# EAGLE design Smart_Plant (EAGLE 9.5.1)
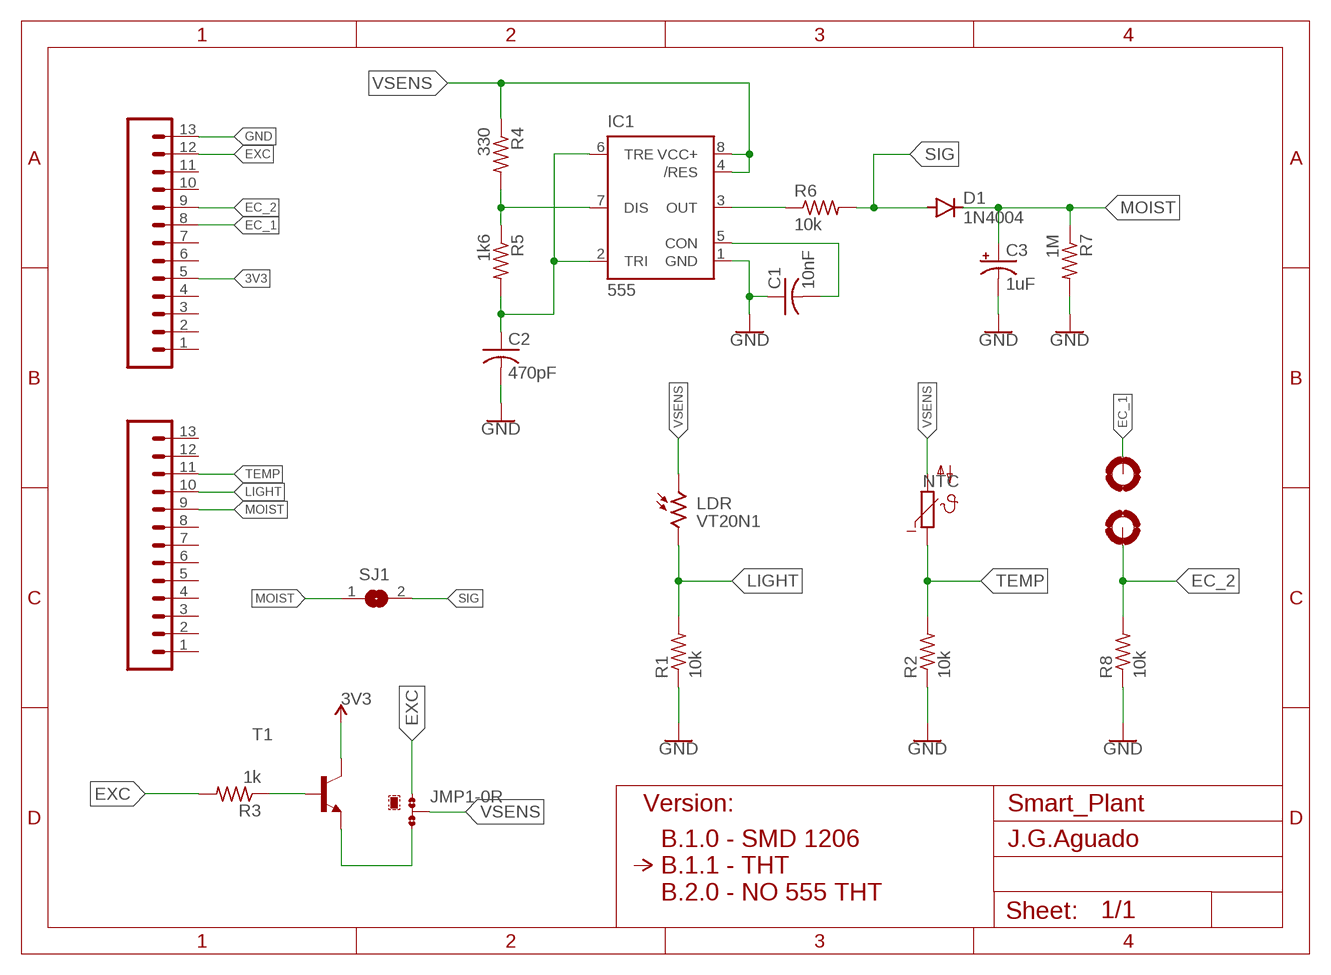
[diagram p0: schematic, sheet 1]

## Parts
C1  10nF  C-US050-025X075  [C050-025X075]
C2  470pF  C-US050-025X075  [C050-025X075]
C3  1uF  CPOL-USE2.5-5  [E2,5-5]
D1  1N4004  [DO41-10]
H1  MOUNT-PAD-ROUND3.0  [3,0-PAD]
H2  MOUNT-PAD-ROUND3.0  [3,0-PAD]
IC1  555  555KIT  [DIP08-KIT]
JMP1  0R-JUMPB  [B0R-JMP]
JP1  CONN_13  [1X13]
JP2  CONN_13  [1X13]
LDR  VT20N1  [TO46-VT200]
NTC  R1206  NTC640  [P640]
R1  10k  R-US_0207/10  [0207/10]
R2  10k  R-US_0207/10  [0207/10]
R3  1k  R-US_0207/10  [0207/10]
R4  330  R-US_0207/10  [0207/10]
R5  1k6  R-US_0207/10  [0207/10]
R6  10k  R-US_0207/10  [0207/10]
R7  1M  R-US_0207/10  [0207/10]
R8  10k  R-US_0207/10  [0207/10]
SJ1  SJ  [SJ]
T1  -NPN-TO92-ECB  [TO92-ECB]

## Nets
3V3: JP1.5 T1.C ; supply symbol labelled 3.3V
EC_1: H1.B3,0(MOUNT) JP1.8
EC_2: H2.B3,0(MOUNT) JP1.9 R8.2
EXC: JMP1.1 JP1.12 R3.2
GND: C1.1 C2.2 C3.- IC1.1(GND) JP1.13 R1.1 R2.1 R7.2 R8.1
LIGHT: JP2.10 LDR.2 R1.2
MOIST: C3.+ D1.C JP2.9 R7.1 SJ1.1
N$1: R3.1 T1.B
N$3: C2.1 IC1.2(TRI) IC1.6(TRE) R5.2
N$4: IC1.7(DIS) R4.2 R5.1
N$6: IC1.3(OUT) R6.1
N$9: C1.2 IC1.5(CON)
N$10: JMP1.3 T1.E
SIG: D1.A R6.2 SJ1.2
TEMP: JP2.11 NTC.1 R2.2
VSENS: IC1.4(/RES) IC1.8(VCC+) JMP1.2 LDR.1 NTC.2 R4.1
Unconnected: JP1.1 JP1.2 JP1.3 JP1.4 JP1.6 JP1.7 JP1.10 JP1.11 JP2.1 JP2.2 JP2.3 JP2.4 JP2.5 JP2.6 JP2.7 JP2.8 JP2.12 JP2.13

## Notes on the sheet
- Version:
- J.G.Aguado
- B.1.0 - SMD 1206
  B.1.1 - THT 
  B.2.0 - NO 555 THT

## Library data of the parts
C1 C2 = rcl:C-US: CAPACITOR, American symbol; SPICEPREFIX: C
C3 = rcl:CPOL-US: POLARIZED CAPACITOR, American symbol; SPICEPREFIX: C
D1 = diode:1N4004: DIODE general purpose rectifier, 1 A
H1 H2 = holes:MOUNT-PAD-ROUND: MOUNTING PAD, round
IC1 = SparkFun-IC-Special-Function:555: General purpose bipolar Timer Datasheet <http://www.sparkfun.com/datasheets/Components/General/ne555.pdf> SparkFun Products SparkFun SparkPunk Sequencer Kit <https://www.sparkfun.com/products/12707> (KIT-12707) Storefront Component: 555 Timer <https://www.sparkfun.com/products/9273> (COM-09273) Two parts valid for production: VFP: IC-11930 (M7555 PTH) VFP: IC-09173 (555 PTH) - Preferred; PROD_ID: IC-09173; PROD_ID_ALT: IC-11930
JMP1 = jump-0r-smd:0R-JUMP: SMD 0R 0805 Jumper
JP1 JP2 = SparkFun-Connectors:CONN_13: Multi connection point. Often used as Generic Header-pin footprint for 0.1 inch spaced/style header connections On any of the 0.1 inch spaced packages, you can populate with these: Break Away Headers - Straight <https://www.sparkfun.com/products/116> (PRT-00116) Break Away Male Headers - Right Angle <https://www.sparkfun.com/products/553> (PRT-00553) Female Headers <https://www.sparkfun.com/products/115> (PRT-00115) Break Away Headers - Machine Pin <https://www.sparkfun.com/products/117> (PRT-00117) Break Away Female Headers - Swiss Machine Pin <https://www.sparkfun.com/products/743> (PRT-00743) For SCREWTERMINALS and SPRING TERMINALS visit here: Screw Terimnals on SparkFun.com <https://www.sparkfun.com/search/results?term=Screw+Terminals> (5mm/3.5mm/2.54mm spacing) This device is also useful as a general connection point to wire up your design to another part of your project. Our various solder wires solder well into these plated through hole pads. Hook-Up Wire - Assortment (Stranded, 22 AWG) <https://www.sparkfun.com/products/11375> (PRT-11375) Hook-Up Wire - Assortment (Solid Core, 22 AWG) <https://www.sparkfun.com/products/11367> (PRT-11367) View the entire wire category on our website here <https://www.sparkfun.com/categories/141> Special notes: Molex polarized connector foot print use with SKU : PRT-08231 with associated crimp pins and housings. 1MM SMD Version SKU: PRT-10208 NOTES ON THE VARIANTS LOCK and LOCK_LONGPADS... This footprint was designed to help hold the alignment of a through-hole component (i.e. 6-pin header) while soldering it into place. You may notice that each hole has been shifted either up or down by 0.005 of an inch from it's more standard position (which is a perfectly straight line). This slight alteration caused the pins (the squares in the middle) to touch the edges of the holes. Because they are alternating, it causes a "brace" to hold the component in place. 0.005 has proven to be the perfect amount of "off-center" position when using our standard breakaway headers. Although looks a little odd when you look at the bare footprint, once you have a header in there, the alteration is very hard to notice. Also,if you push a header all the way into place, it is covered up entirely on the bottom side.
LDR = photo-elements:VT2*: Photoconductive Cell VT200 Series Source: http://optoelectronics.perkinelmer.com/content/Datasheets/DTS_vt200seriesdatasheet.pdf
NTC = ptc-ntc:NTC640: PHILIPS NTC; OC_FARNELL: unknown; OC_NEWARK: unknown
R1-R8 = rcl:R-US_: RESISTOR, American symbol; SPICEPREFIX: R
SJ1 = jumper:SJ: SMD solder JUMPER
T1 = transistor:*-NPN-: NPN Transistror BF959 corrected 2008.03.06

## Net classes
0 default: clearance 0.205 mm

## Board
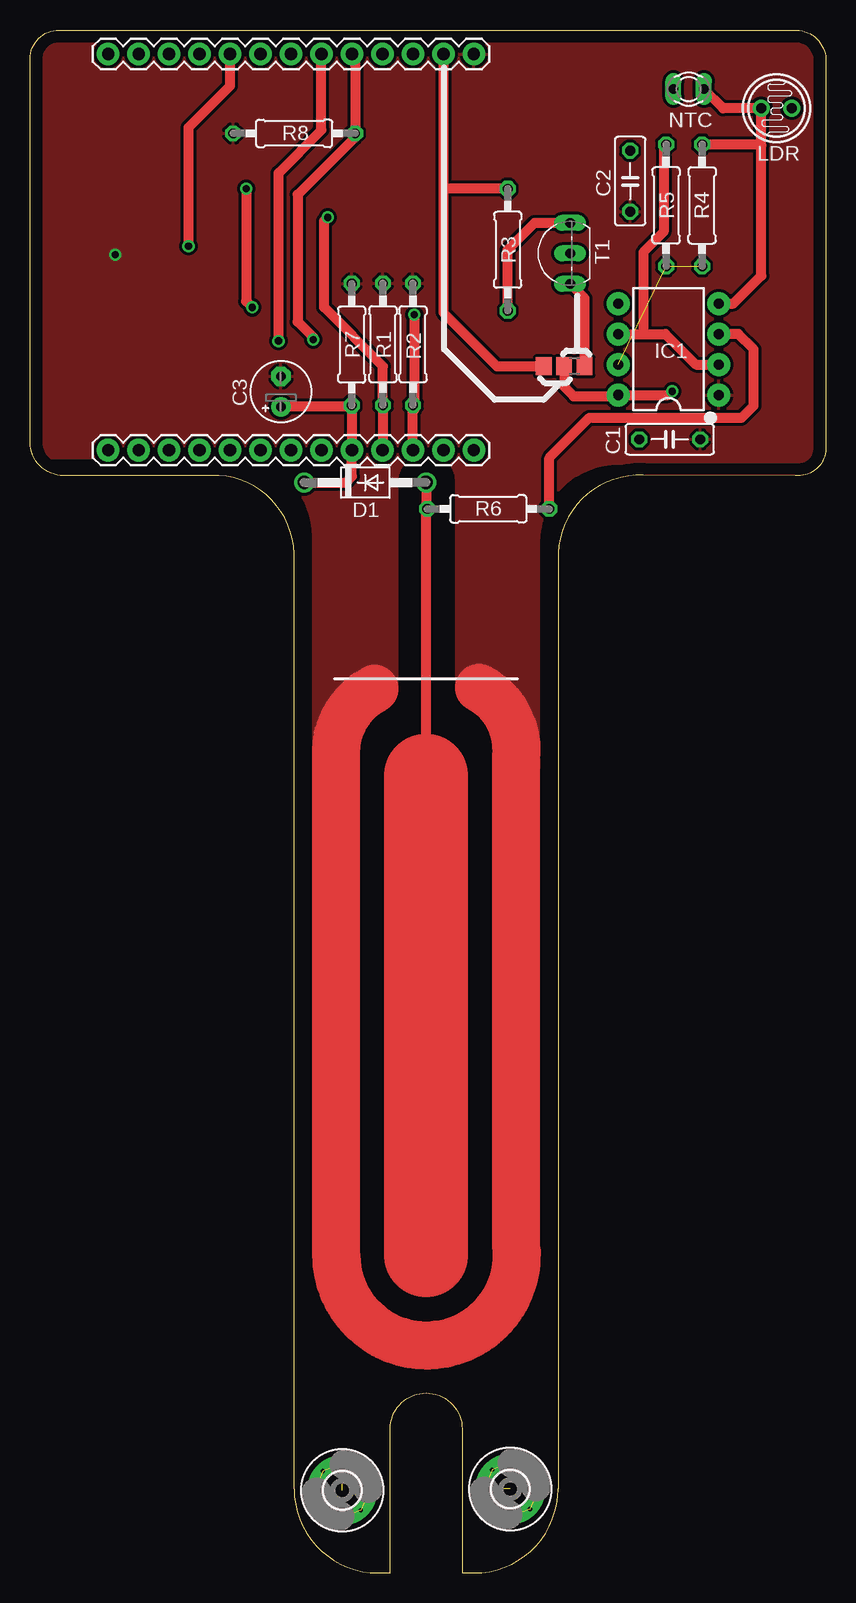
[diagram p1: board, top side]
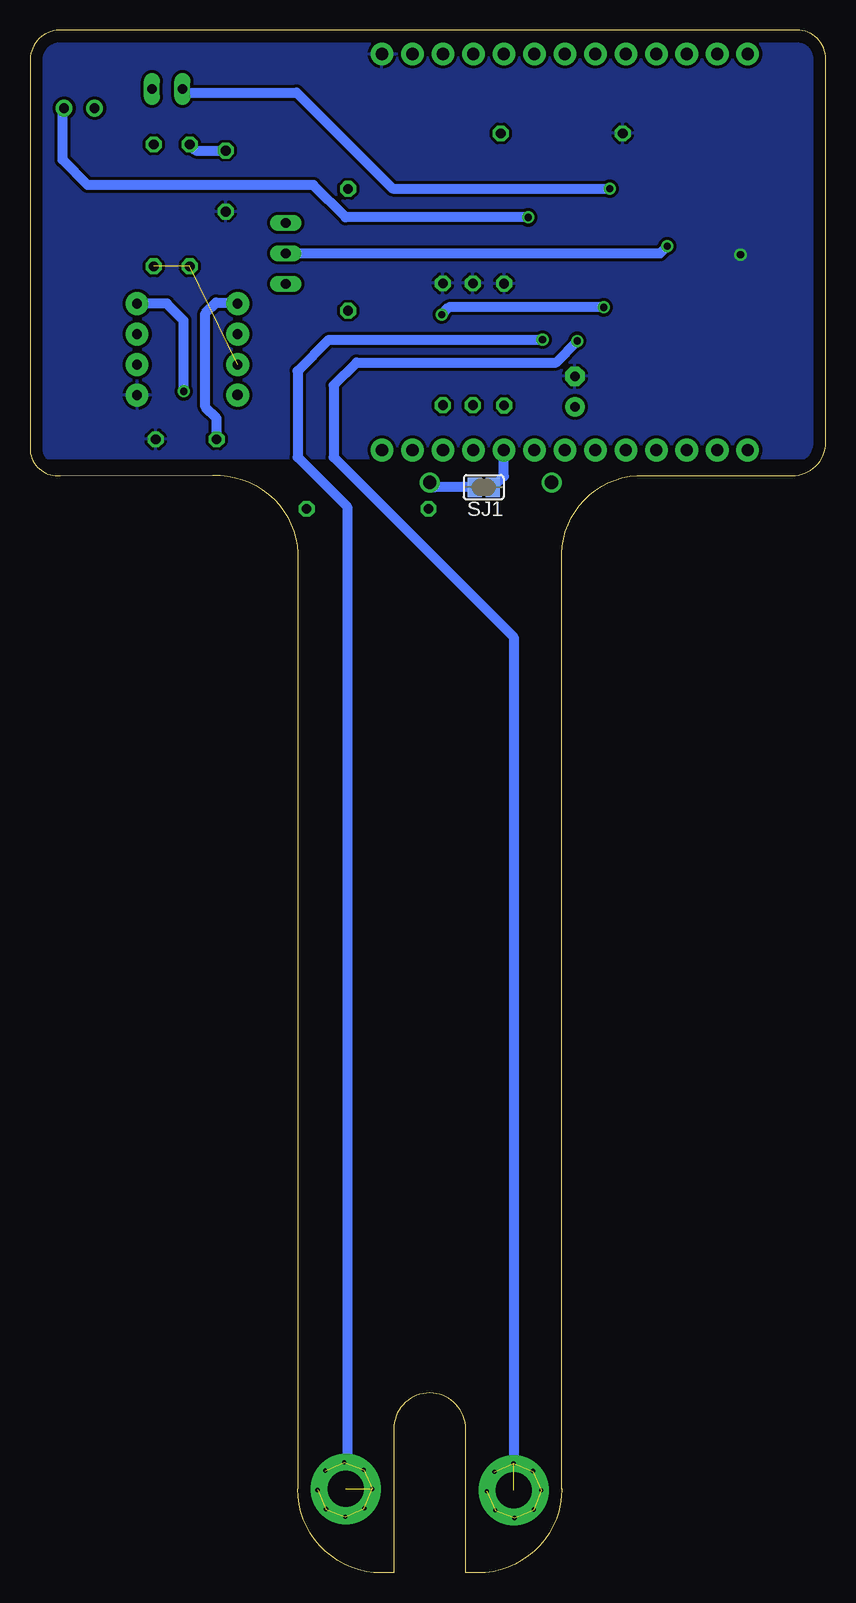
[diagram p2: board, bottom side, seen from below]

Size 66.32 x 128.62 mm. Coordinates in mm from the lower left corner, seen from the top.
Outline: 2.42,128.62 63.65,128.62 arc-90 66.32,126.21 66.32,123.86 66.29,121.46 66.29,98.01 66.32,96.86 66.32,93.53 arc-90 63.78,91.49 51.11,91.5 arc90 44.01,85 44.01,7 arc-90 37.01,0 36.01,0 36.01,12 arc90 33.01,15 arc90 30.01,12 30.01,0 29.01,0 arc-90 22.01,7 22.01,84.99 arc90 15.11,91.49 2.54,91.49 arc-90 0.01,94.52 0.01,126.21 arc-90 2.42,128.62
Copper layers (1*16): Top 0.035mm / dielectric 1.5mm / Bottom 0.035mm
Design rules "default": minimum track width 6mil, minimum drill 0.35mm, track to track 6mil, track to pad 6mil, pad to pad 6mil, via to via 6mil, smd to smd 6mil, copper to edge 40mil, drill to drill 6mil, minimum pad ring 10mil, minimum via ring 8mil, stop-mask expansion 4mil, vias tented up to drill 0mil, thermal gap 10mil

### Footprints (pad centres in the part's own frame; a part is rotated, then mirrored left to right if it is on the bottom)
C050-025X075 = drill 0.813 octagon: 1 -2.54,0; 2 2.54,0
E2,5-5 = drill 0.813 pad 1.6: + -1.27,0 | drill 0.813 pad 1.6 octagon: - 1.27,0
DO41-10 = drill 1.118: A 5.08,0; C -5.08,0
3,0-PAD = drill 3 pad 5.842: B3,0 0,0
DIP08-KIT = drill 0.813 pad 1.905: 1 -3.81,-4.191; 2 -1.27,-4.191; 3 1.27,-4.191; 4 3.81,-4.191; 5 3.81,4.191; 6 1.27,4.191; 7 -1.27,4.191 | drill 0.864 pad 1.905: 8 -3.81,4.191
B0R-JMP = smd 1.5 x 1.3: 1 0,1.7; 2 0,0; 3 0,-1.7
1X13 = drill 1.016 pad 1.88: 1 0,0; 2 2.54,0; 3 5.08,0; 4 7.62,0; 5 10.16,0; 6 12.7,0; 7 15.24,0; 8 17.78,0; 9 20.32,0; 10 22.86,0; 11 25.4,0; 12 27.94,0; 13 30.48,0
TO46-VT200 = drill 0.8 pad 1.4: 1 -1.27,0; 2 1.27,0
P640 = drill 0.813 long: 1 -1.27,0; 2 1.27,0
0207/10 = drill 0.813 octagon: 1 -5.08,0; 2 5.08,0
SJ = smd 1.168 x 1.6: 1 -0.762,0; 2 0.762,0
TO92-ECB = drill 0.813 long: B 2.54,0; C 0,0; E -2.54,0

### Placement (x,y rotation side)
C1  53.31,94.5 180 top
C2  50.01,116.02 270 top
C3  20.91,98.48 90 top
D1  27.93,90.9 0 top
H1  26.01,6.9 0 top
H2  40.01,7 0 top
IC1  53.21,102 90 top
JMP1  44.51,100.6 90 top
JP1  6.51,126.62 0 top
JP2  6.51,93.6 0 top
LDR  62.21,122.1 0 top
NTC  54.89,123.7 0 top
R1  29.41,102.42 270 top
R2  31.91,102.42 270 top
R3  39.81,110.3 90 top
R4  56.01,114 270 top
R5  53.01,114 90 top
R6  38.19,88.7 180 top
R7  26.81,102.4 90 top
R8  22.01,120 0 top
SJ1  28.51,90.5 180 bottom
T1  45.01,110 90 top

### Tracks (layer width: path | path; a pad name or v marks a point on that pad's centre or on a via)
3V3  (via drill 0.6)
  Top 0.813: v13.21,110.6 13.21,120.5 16.67,123.96 JP1.5
  Bottom 0.813: T1.C 13.81,110 v13.21,110.6
EC_1  (via drill 0.35, 0.6)  (9 unrouted)
  Top 0.813: v20.71,102.7 20.71,116.7 24.29,120.28 JP1.8
  Bottom 0.813: v20.71,102.7 v20.7,102.71 20.67,102.71 22.48,100.9 39.11,100.9 41.01,99 41.01,93 26.01,78 26.01,7
  other vias: 23.71,6.9 24.41,8.5 26.02,9.13 27.62,8.44 28.26,6.82 27.56,5.22 25.94,4.59 24.35,5.28
EC_2  (via drill 0.35, 0.6)  (8 unrouted)
  Top 0.813: JP1.9 27.09,125.7 R8.2 27.09,119.68 22.31,114.9 22.31,104.3 23.61,103 v23.61,102.8
  Bottom 0.813: v23.61,102.8 41.41,102.8 44.01,100.2 44.01,93 39.9,88.89 39.9,7.11 H2.B3,0
  other vias: 37.81,7 38.51,8.6 40.12,9.23 41.72,8.54 42.36,6.92 41.66,5.32 40.04,4.69 38.45,5.38
EXC
  Top 0.813: JP1.12 34.45,115.4 | 34.45,115.4 34.45,105.06 38.91,100.6 JMP1.1 | R3.2 39.79,115.4 34.45,115.4
GND  (via drill 0.6)
  Top 4: 37.41,73.8 arc-68 40.51,67.99 40.51,27.44 arc-187 25.51,26.5 25.51,68.5 arc-62 28.71,73.7
  other vias: 7.11,109.9
  pour Bottom (isolate 0.254): 0.01,128.62 66.32,128.62 66.32,92.99 0.01,92.99
  pour Top (isolate 0.254): 66.51,128.62 0.2,128.62 0.2,92.99 17.02,92.99 arc-90 23.61,86.4 23.61,67.3 27.11,67.3 27.11,73.5 30.61,73.5 30.61,91 arc-90 33.06,93.45 arc-90 35.51,91 35.51,74 arc-90 42.41,67.1 42.41,85.9 arc-90 49.01,92.5 66.51,92.49
LIGHT  (via drill 0.6)
  Top 0.813: JP2.10 29.41,93.64 R1.2 29.41,100.6 24.51,105.5 24.51,112.7 v24.81,113
  Bottom 0.813: v24.81,113 40.01,113 42.71,115.7 61.51,115.7 63.61,117.8 63.61,121.97 LDR.2
MOIST
  Top 0.813: C3.+ 26.7,97.21 R7.1 26.83,97.3 JP2.9 26.83,91.42 26.31,90.9 D1.C 23.15,90.9
  Bottom 0.813: SJ1.1 26.83,91.42 JP2.9
N$1
  Top 0.813: R3.1 39.81,110.3 42.05,112.54 T1.B
N$3
  Top 0.813: IC1.6 51.11,103.27 | 51.11,103.27 52.94,103.27 55.48,100.73 IC1.2 | R5.2 52.81,118.88 52.81,111.8 51.11,110.1 51.11,103.27
  Bottom 0.813: R5.2 52.49,118.56 C2.1
N$4  (2 unrouted)
N$6
  Top 0.813: R6.1 43.27,92.96 46.61,96.3 59.31,96.3 60.31,97.3 60.31,102 59.04,103.27 IC1.3
N$9
  Bottom 0.813: C1.2 50.77,96.26 51.71,97.2 51.71,105 50.81,105.9 49.11,105.9 IC1.5
N$10
  Top 0.813: JMP1.3 46.21,106.26 T1.E
SIG
  Top 0.813: 33.01,66.47 33.01,88.7 | R6.2 33.01,88.7 | D1.A 33.01,88.7
  Top 7: 33.01,26.5 33.01,66.47
  Bottom 0.813: SJ1.2 32.61,90.5 D1.A
TEMP  (via drill 0.6)
  Top 0.813: JP2.11 31.91,96.8 | 31.91,96.8 R2.2 | v18.01,115.4 18.01,106 v18.51,105.5 | v32.01,104.9 32.01,96.9 31.91,96.8
  Bottom 0.813: NTC.1 53.32,123.4 44.11,123.4 36.11,115.4 v18.01,115.4 | v18.51,105.5 31.41,105.5 v32.01,104.9
VSENS  (via drill 0.6)
  Top 0.813: JMP1.2 44.51,98.9 45.31,98.1 48.93,98.1 IC1.8 53.2,98.19 v53.51,98.5 | IC1.4 58.62,105.81 60.94,108.13 60.94,119 | 60.94,119 LDR.1 57.76,122.1 NTC.2 | R4.1 60.86,119.08 60.94,119
  Bottom 0.813: v53.51,98.5 53.51,104.4 54.92,105.81 IC1.4